# Altium schematic sheet VREG AOZ1021AI +3V3 3A.SchDoc
size 134 x 74 mm
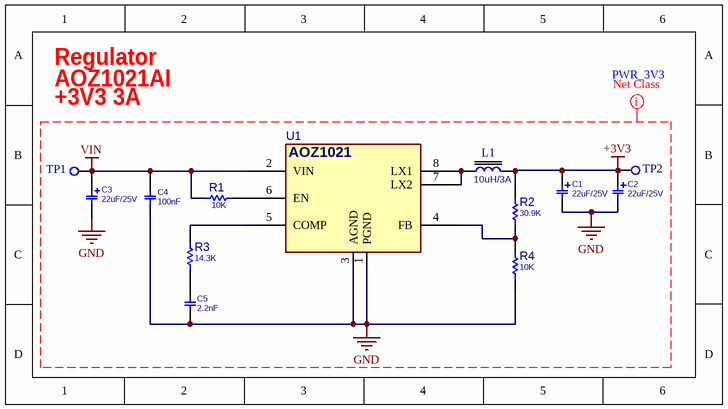
[diagram p0: VREG AOZ1021AI +3V3 3A.SchDoc]

## Parts
C1  22uF/25V  [C_TN_A]
C2  22uF/25V  [C_TN_A]
C3  22uF/25V  [C_TN_A]
C4  100nF  [C0603S]
C5  2.2nF  [C0603S]
L1  10uH/3A  [L_8X8]
R1  10K  [R0603S]
R2  30.9K  [R0603S]
R3  14.3K  [R0603S]
R4  10K  [R0603S]
TP1  Test Point  [TPSMD_C1]  (value not drawn)
TP2  Test Point  [TPSMD_C1]  (value not drawn)
U1  AOZ1021AI  [SO_8]  (value not drawn)

## Nets
+3V3: C1.1 C2.1 L1.2 R2.1 TP2.1(TP)
GND: C1.2 C2.2 C3.2 C4.1 C5.1 R4.2 U1.1(PGND) U1.3(AGND)
VIN: C3.1 C4.2 R1.2 TP1.1(TP) U1.2(VIN)
NetC5_2: C5.2 R3.2
NetL1_1: L1.1 U1.7(LX2) U1.8(LX1)
NetR1_1: R1.1 U1.6(EN)
NetR2_2: R2.2 R4.1 U1.4(FB)
NetR3_1: R3.1 U1.5(COMP)

## Layout directives
net class PWR_3V3: +3V3, GND, VIN

## Notes on the sheet
- AOZ1021AI
- Regulator
- PWR_3V3
- +3V3 3A
- (in symbol VREG_AOZ1021AI_SO8) AOZ1021

## Library data of the parts
C1-C3 = CAP_SMD_TAN: CAP, SMD, TAN; PARAM: 25V; VALUE: 22uF/25V
C4 C5 = CAP_SMD_MLCC: CAP, SMD, MLCC; PARAM: 50V; DESC: CAP, MLCC, 1nF, 50V, C0G, 10%, 0402; MANF_P#: MANF_PART#; MANF: Murata; PARAM2: C0G, 10%; PRICE: 100= 1$; ASSEMBLY: ASSEMBLY
  C4: VALUE: 100nF
  C5: VALUE: 2.2nF
L1 = INDPWR_SMD: IND, PWR, SMD; VALUE: 10uH/3A
R1-R4 = RES_SMD: RES, SMD; MANF_P#: RK73H1ETTP4701F; MANF: KOA SPEER; PARAM: 0.063W; DESC: DESCRIPTION; DIST#: MOUSER; PARAM2: 1%; ASSEMBLY: ASSEMBLY; PRICE: 100= 0.5$
  R1 R4: VALUE: 10K
  R2: VALUE: 30.9K
  R3: VALUE: 14.3K
U1 = VREG_AOZ1021AI_SO8: REG, Switching, Buck, 3A, ADJ, 500KHz, 4.5~16VIN, SO-8; MANF: AOSMD; PARAM: 3A, ADJ; ASSEMBLY: ASSEMBLY; PRICE: 1.33$, 1800t@PAYA; PARAM2: 500KHz, 4.5~16VIN; MANF_P#: AOZ1021AI; VALUE: AOZ1021AI